# Altium schematic sheet SolarPanelCharger.SchDoc
size A4
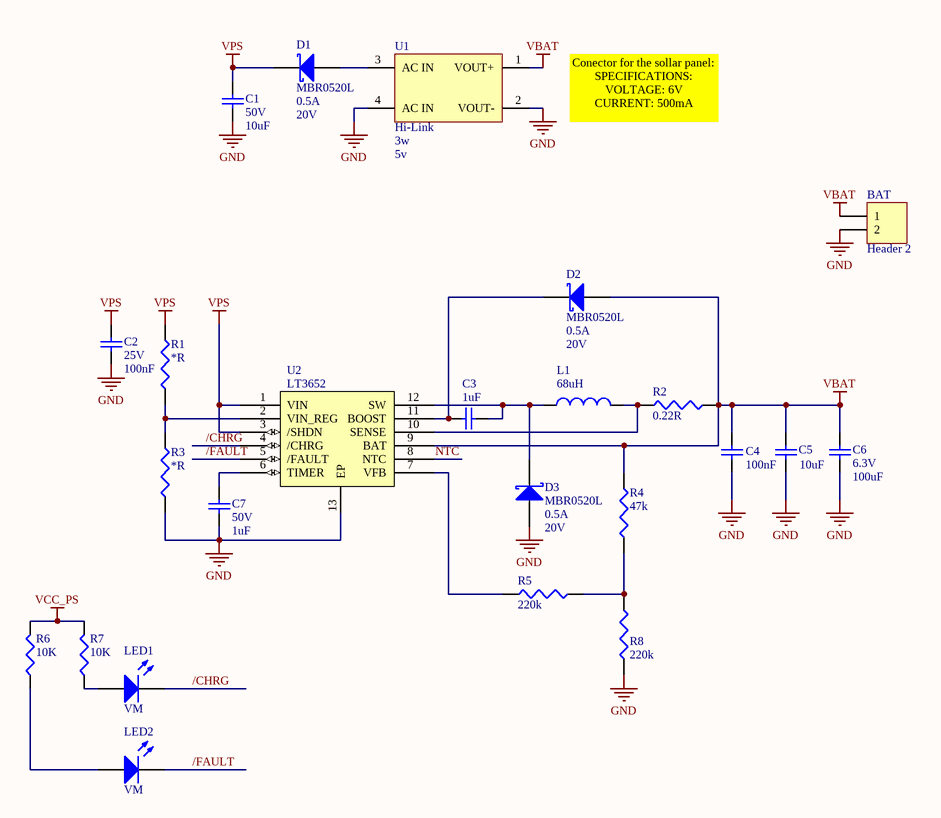
[diagram p0: SolarPanelCharger.SchDoc]

## Parts
BAT  Header 2  [CONN XH2.54 - 2]
C1  value 10uF  Tensão: 50V  [CC1206]  (hidden comment: Capacitor Cerâmico)
C2  value 100nF  Tensão: 25V  [CC0603]  (hidden comment: Capacitor Cerâmico)
C3  value 1uF  [CC0603]  (hidden comment: Capacitor Cerâmico)
C4  value 100nF  [CC0603]  (hidden comment: Capacitor Cerâmico)
C5  value 10uF  [CC0805]  (hidden comment: Capacitor Cerâmico)
C6  value 100uF  Tensão: 6.3V  [CC1206]  (hidden comment: Capacitor Cerâmico)
C7  value 1uF  Tensão: 50V  [CC0603]  (hidden comment: Capacitor Cerâmico)
D1  MBR0520L  Corrente: 0.5A  Tensão: 20V  [SOD-123F]
D2  MBR0520L  Corrente: 0.5A  Tensão: 20V  [SOD-123F]
D3  MBR0520L  Corrente: 0.5A  Tensão: 20V  [SOD-123F]
L1  value 68uH  [MURATA 4600]  (hidden comment: Indutor)
LED1  value VM  [LED 0603]  (hidden comment: LED)
LED2  value VM  [LED 0603]  (hidden comment: LED)
R1  value *R  [CC0603]  (hidden comment: Resistor)
R2  value 0.22R  [CC1206]  (hidden comment: Resistor)
R3  value *R  [CC0603]  (hidden comment: Resistor)
R4  value 47k  [CC0603]  (hidden comment: Resistor)
R5  value 220k  [CC0603]  (hidden comment: Resistor)
R6  value 10K  [CC0603]  (hidden comment: Resistor)
R7  value 10K  [CC0603]  (hidden comment: Resistor)
R8  value 220k  [CC0603]  (hidden comment: Resistor)
U1  Hi-Link  Potência: 3w  Tensão: 5v  [Fonte-HILINK]
U2  LT3652  [MSOP-12N_EP]

## Nets
GND: BAT.2 C1.1 C2.1 C4.1 C5.1 C6.1 C7.1 D3.1(A) R3.1 R8.1 U1.2(VOUT-) U1.4(AC_IN) U2.13(EP)
VBAT: BAT.1 C4.2 C5.2 C6.2 D2.1(A) R2.2 R4.2 U1.1(VOUT+) U2.9(BAT)
VCC_PS: R6.2 R7.2
VPS: C1.2 C2.2 D1.2(K) R1.2 U2.1(VIN) U2.3(/SHDN)
/CHRG: LED1.2(K) U2.4(/CHRG)
/FAULT: LED2.2(K) U2.5(/FAULT)
NTC: U2.8(NTC)
NetC3_1: C3.1 D2.2(K) U2.11(BOOST)
NetC3_2: C3.2 D3.2(K) L1.1 U2.12(SW)
NetC7_2: C7.2 U2.6(TIMER)
NetD1_1: D1.1(A) U1.3(AC_IN)
NetL1_2: L1.2 R2.1 U2.10(SENSE)
NetLED1_1: LED1.1(A) R7.1
NetLED2_1: LED2.1(A) R6.1
NetR1_1: R1.1 R3.2 U2.2(VIN_REG)
NetR4_1: R4.1 R5.1 R8.2
NetR5_2: R5.2 U2.7(VFB)

## Notes on the sheet
- Conector for the sollar panel:
  SPECIFICATIONS:
  VOLTAGE: 6V
  CURRENT: 500mA
- Projeto:
- Tamanho:
- Data:
- A4
- Eng. Felipe Navarro
- Hora:
- Revisão:
- Folha
- de
- Arquivo:

## Library data of the parts
BAT = Header 2: Header, 2-Pin; ChinesePrice: 0,10000; Chinês: Proved - Local; Value: Barra de 40 pinos - ATENÇÃO; Corrente: *; Potência: *; Supplier 1: Digi-Key; Supplier Part Number 1: A26509-40-ND; Tensão: *; Obs:: *; Tolerância: *; ComponentLink1Description: Datasheet; ComponentLink1URL: D:\Tecnoclade\Datasheet\!DataMissing.pdf
C1 C5 = Cap 10uF 50V 1206 X5R: Capacitor (Semiconductor SIM Model); Chinês: -----; ChinesePrice: 0,00000; Corrente: *A; Potência: *W; Obs:: X5R, CL31A106KBHNNNE; Tolerância: ±10%; Supplier 1: Digi-Key; Supplier Part Number 1: 1276-2876-1-ND; ComponentLink1Description: Datasheet; ComponentLink1URL: D:\Tecnoclade\Datasheet\!DataMissing.pdf
C2 C4 = Cap 100nF 25V 0603 X7R: Capacitor (Semiconductor SIM Model); Chinês: Local; ChinesePrice: 0,00246; Corrente: *A; Potência: *W; Obs:: X7R; Tolerância: ±10%; Supplier 1: Digi-Key; Supplier Part Number 1: 490-1524-1-ND; ComponentLink1Description: Datasheet; ComponentLink1URL: D:\Tecnoclade\Datasheet\!DataMissing.pdf
C3 C7 = Cap 1uF 50V 0603 X5R: Capacitor (Semiconductor SIM Model); Chinês: Local; ChinesePrice: 0,01100; Corrente: *A; Potência: *W; Obs:: X5R; Tolerância: ±10%; Supplier 1: Digi-Key; Supplier Part Number 1: 587-2400-1-ND; ComponentLink1Description: Datasheet; ComponentLink1URL: D:\Tecnoclade\Datasheet\!DataMissing.pdf
C6 = Cap 100uF 6.3V 1206 X5R: Capacitor (Semiconductor SIM Model); Chinês: -----; ChinesePrice: 0,00000; Corrente: *A; Potência: *W; Obs:: X5R; Tolerância: ±20%; Supplier 1: Digi-Key; Supplier Part Number 1: 490-7217-1-ND; ComponentLink1Description: Datasheet; ComponentLink1URL: D:\Tecnoclade\Datasheet\!DataMissing.pdf
D1-D3 = DS 20V 0.5A 385mV SOD-123: Schottky Diode; ChinesePrice: 0,00000; Chinês: ----; Value: Vf=385mV@500mA; Obs:: Fast Recovery =< 500ns, > 200mA (Io); Potência: *; Supplier 1: Digi-Key; Supplier Part Number 1: MBR0520L-TPMSCT-ND; Tolerância: *; ComponentLink1Description: Datasheet; ComponentLink1URL: D:\Tecnoclade\Datasheet\!DataMissing.pdf
L1 = Ind 68uH 1.05A: Inductor; ChinesePrice: 0,00000; Chinês: -----; Obs:: Z=0R0251; Supplier 1: Digi-Key; Supplier Part Number 1: 811-1181-1-ND; Tensão: *; ComponentLink1Description: Datasheet; ComponentLink1URL: http://www.murata-ps.com/data/magnetics/kmp_4600.pdf
LED1 LED2 = LED: ChinesePrice: 0,00000; Chinês: ----; Corrente: *; Potência: *; Supplier 1: Digi-Key; Supplier Part Number 1: 160-1479-1-ND; Tensão: *; Obs:: *; Tolerância: *; ComponentLink1Description: Datasheet; ComponentLink1URL: D:\Tecnoclade\Datasheet\!DataMissing.pdf
R1 R3-R5 R8 = Res - $Val $% $Footprint $Pot: ChinesePrice: 0,00000; Chinês: ----; Corrente: *A; Potência: 1/10W; Tensão: *V; Tolerância: ±*%; Supplier 1: Digi-Key; Supplier Part Number 1: --Del; Obs:: *; ComponentLink1Description: Datasheet; ComponentLink1URL: D:\Tecnoclade\Datasheet\!DataMissing.pdf
R2 = Res 0.22R 1% 1206 1/4W: ChinesePrice: 0,00000; Chinês: ----; Corrente: *A; Potência: 1/4W; Tensão: *V; Tolerância: 1%; Supplier 1: Digi-Key; Supplier Part Number 1: P.22RCT-ND; Obs:: *; ComponentLink1Description: Datasheet; ComponentLink1URL: http://industrial.panasonic.com/lecs/www-data/pdf/AOA0000/AOA0000CE3.pdf
R6 R7 = Res 10K 1% 0603 1/10W: ChinesePrice: 0,00089; Chinês: Local; Corrente: *A; Potência: 1/10W; Tensão: *V; Tolerância: ±1%; Supplier 1: Digi-Key; Supplier Part Number 1: P10.0KHCT-ND; Obs: *; ComponentLink1Description: Datasheet; ComponentLink1URL: D:\Tecnoclade\Datasheet\!DataMissing.pdf
U1 = Fonte Hi-Link: Fonte chaveada isolada; ChinesePrice: 0,00000; Chinês: ----; Corrente: 4; Supplier 1: Digi-Key; Value: *; Obs:: *; Tolerância: *; ComponentLink1Description: Datasheet; ComponentLink1URL: D:\Tecnoclade\Datasheet\IE1212S.pdf
U2 = LT3652: Power Tracking 2A Battery  Charger for Solar Power; ChinesePrice: 0,00000; Chinês: ----; Corrente: *; Potência: *; Supplier 1: Digi-Key; Supplier Part Number 1: LT3652EMSE#PBF-ND; Tensão: *; Value: *; Obs:: *; Tolerância: *; ComponentLink1Description: Datasheet; ComponentLink1URL: http://www.linear.com/docs/28522